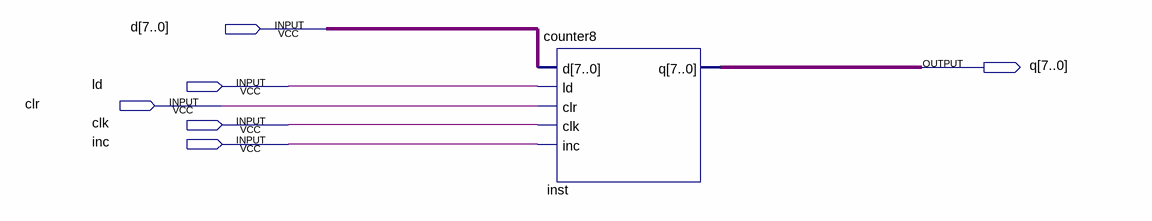
[diagram p0: schematic sheet]
// Quartus schematic lab4.bdf as structural Verilog: 1 symbols, 6 pins
module lab4 (
  input  [7:0] d,
  input  ld,
  input  clr,
  input  clk,
  input  inc,
  output [7:0] q
);

  counter8 inst (.d(d), .ld(ld), .clr(clr), .clk(clk), .inc(inc), .q(q));
endmodule
